# Altium project Middle Row.PrjPcb
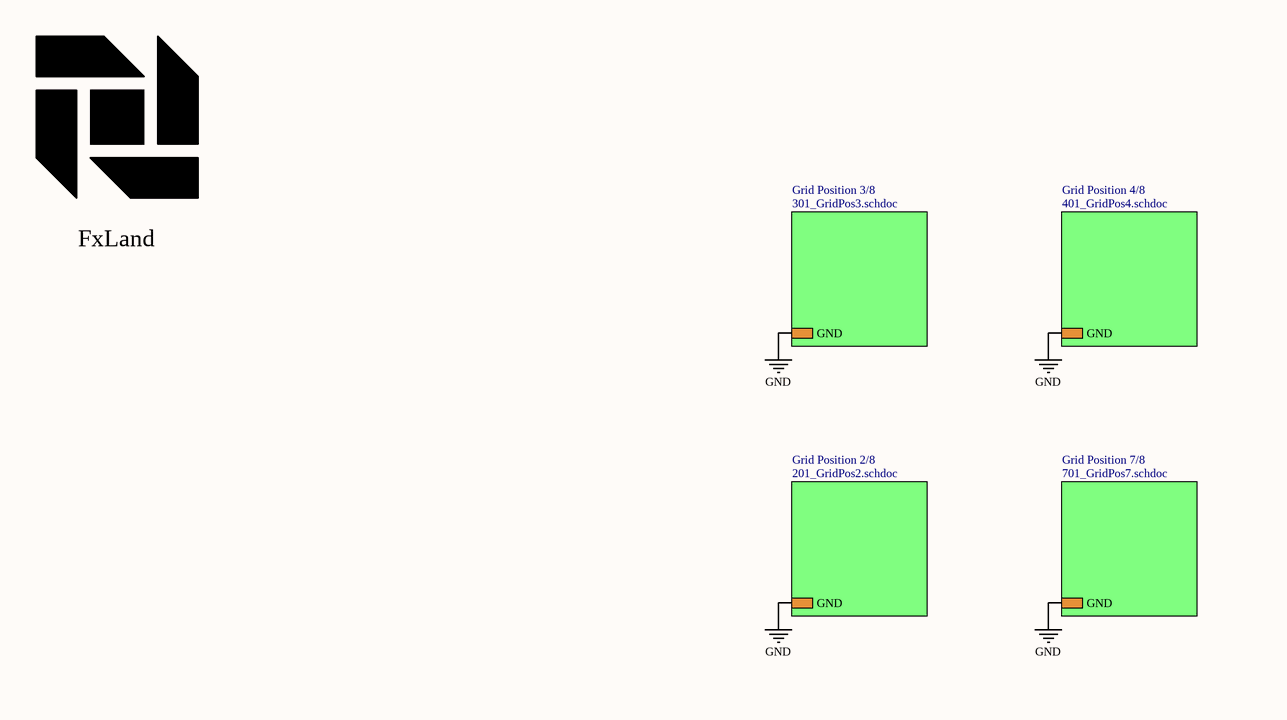
[diagram p0: 001_top.SchDoc, left]
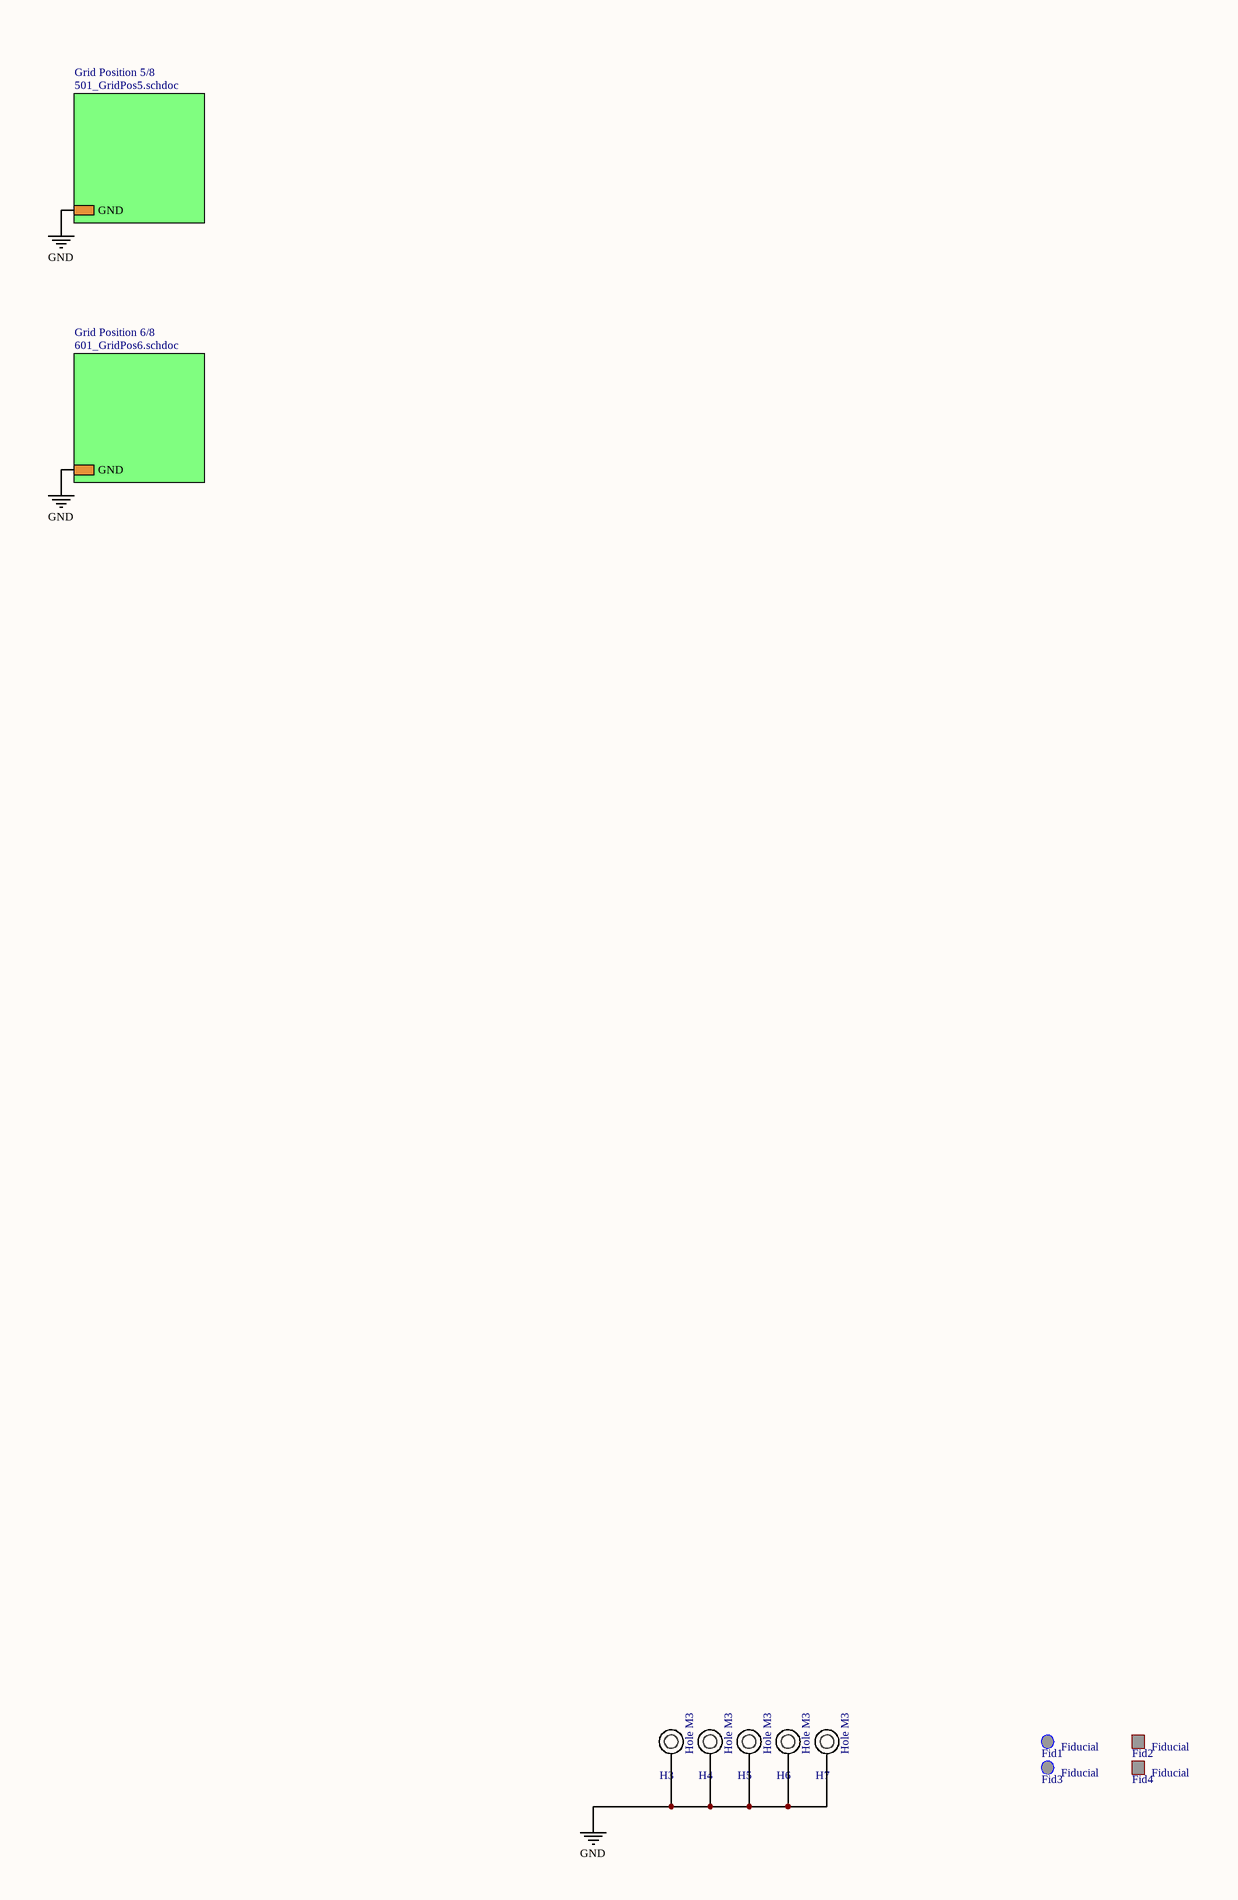
[diagram p1: 001_top.SchDoc, right]
DocNumber: P234; Rev: 1.7
7 sheets, 22 parts. Net scope: hierarchical (ports join the sheet entries above them; power ports are global).
Board file: Middle Row.PcbDoc
Sheets:
  001_top.SchDoc
    Grid Position 2/8 = 201_GridPos2.SchDoc
    Grid Position 4/8 = 401_GridPos4.SchDoc
    Grid Position 5/8 = 501_GridPos5.SchDoc
    Grid Position 3/8 = 301_GridPos3.SchDoc
    Grid Position 6/8 = 601_GridPos6.SchDoc
    Grid Position 7/8 = 701_GridPos7.SchDoc

## Sheet 001_top.SchDoc
size A2; Organization: Greenfield Tech Solutions; Address1: Molendreef 33; Address2: Ossendrecht; Address3: 4641CS; Address4: The Netherlands; DocumentNumber: P234; Revision: 1.7; SheetNumber: 1; SheetTotal: 7

### Parts
Fid1  Fiducial  [FidR_1.0mm]
Fid2  Fiducial  [FidS_1.0mm]
Fid3  Fiducial  [FidR_1.0mm]
Fid4  Fiducial  [FidS_1.0mm]
H3  Hole M3  [HOLE_M3]
H4  Hole M3  [HOLE_M3]
H5  Hole M3  [HOLE_M3]
H6  Hole M3  [HOLE_M3]
H7  Hole M3  [HOLE_M3]
Logo_FxLand?  FxLand  [Logo_FxLand_3]  (value not drawn)

### Sub-sheets
Grid Position 2/8 = 201_GridPos2.schdoc: GND
Grid Position 3/8 = 301_GridPos3.schdoc: GND
Grid Position 4/8 = 401_GridPos4.schdoc: GND
Grid Position 5/8 = 501_GridPos5.schdoc: GND
Grid Position 6/8 = 601_GridPos6.schdoc: GND
Grid Position 7/8 = 701_GridPos7.schdoc: GND

### Nets
GND: H3.1 H4.1 H5.1 H6.1 H7.1 ; sheet Grid Position 2/8/GND, sheet Grid Position 4/8/GND, sheet Grid Position 5/8/GND, sheet Grid Position 3/8/GND, sheet Grid Position 6/8/GND, sheet Grid Position 7/8/GND

### Notes on the sheet
- Title
- Size:
- Date:
- File:
- A2
- Number:
- Time:
- Revision:
- Sheet
- of

### Library data of the parts
Fid1 Fid3 = ME0011: Fiducial Round 1mm; Part Number: ME0011; ID: 11; RefVal: Fiducial
Fid2 Fid4 = ME0012: Fiducial Sqaure 1mm; Part Number: ME0012; ID: 12; RefVal: Fiducial
H3-H7 = ME0001: Mounting Hole M3; Part Number: ME0001; ID: 1; RefVal: Hole M3
Logo_FxLand? = ME0008: Logo FxLand 3; Part Number: ME0008; ID: 8; RefVal: FxLand

## Sheet 201_GridPos2.SchDoc
size A2; Organization: Greenfield Tech Solutions; Address1: Molendreef 33; Address2: Ossendrecht; Address3: 4641CS; Address4: The Netherlands; DocumentNumber: P234; Revision: 1.7; SheetNumber: 2; SheetTotal: 7
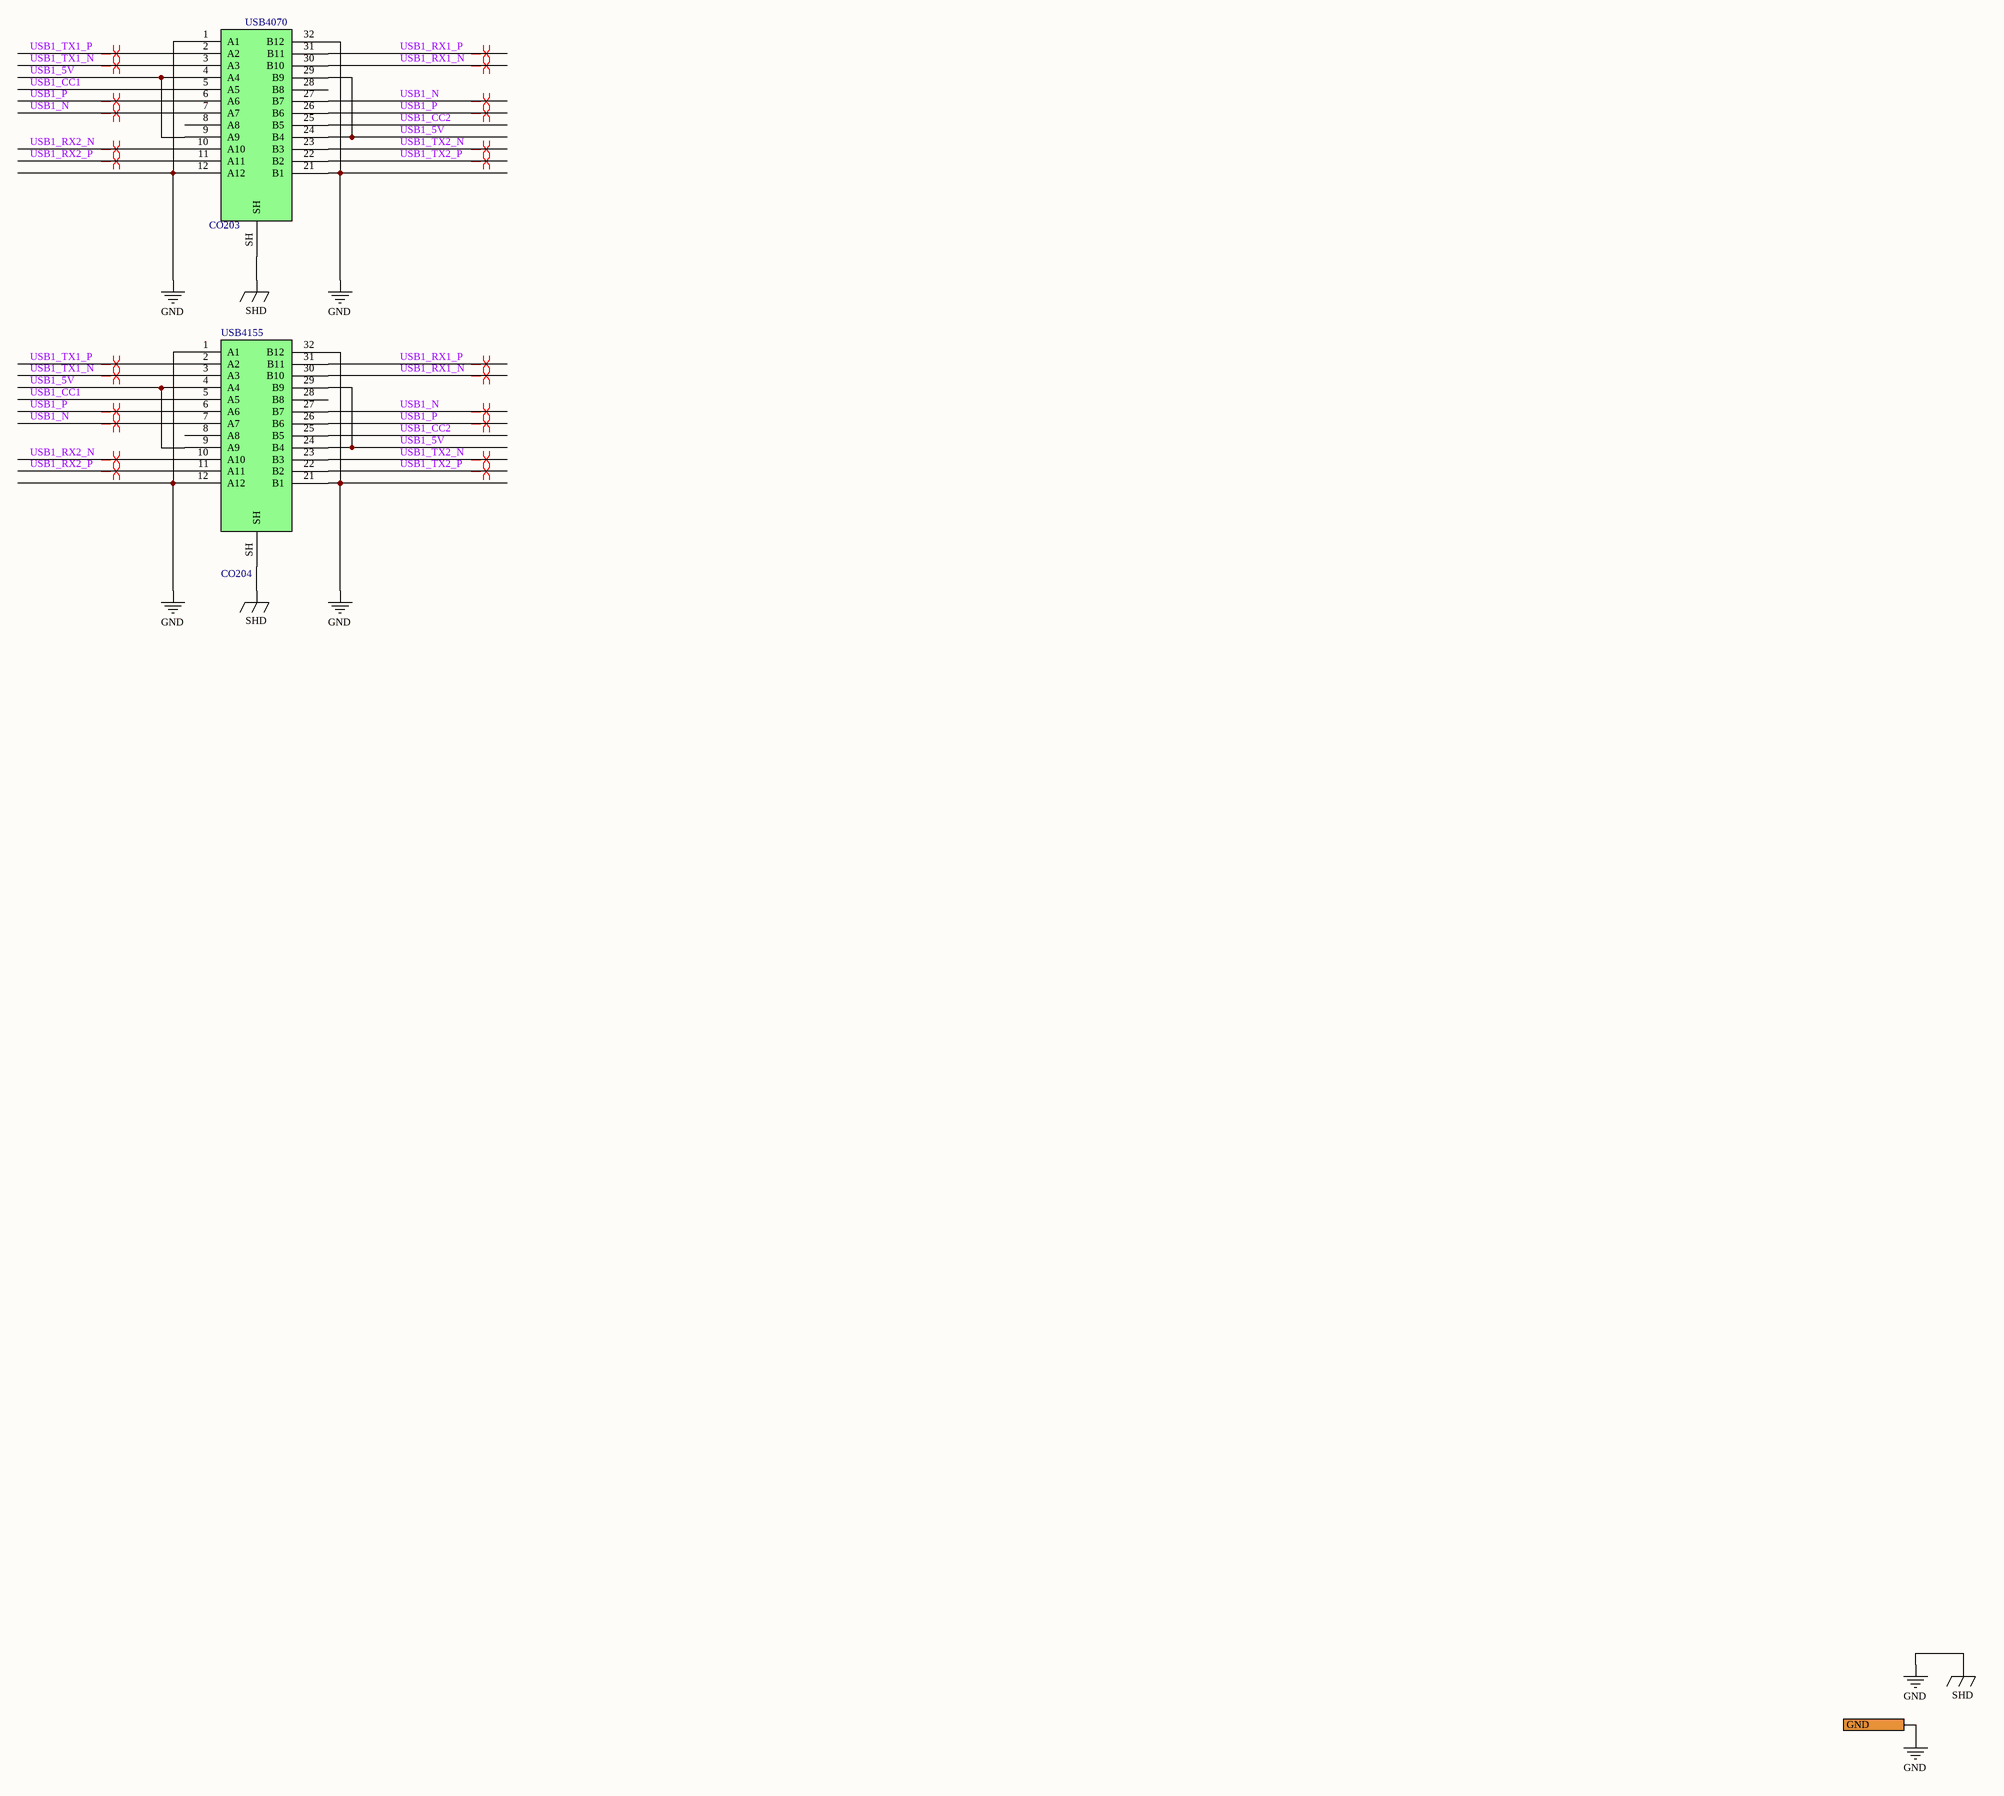
[diagram p2: 201_GridPos2.SchDoc]

### Parts
CO203  USB4070  [USB4070-30-C]
CO204  USB4155  [USB4155-03-C]

### Ports
GND

### Nets
GND: CO203.1(A1) CO203.12(A12) CO203.21(B1) CO203.32(B12) CO203.SH CO204.1(A1) CO204.12(A12) CO204.21(B1) CO204.32(B12) CO204.SH ; port GND  [also labelled SHD]
USB1_5V: CO203.4(A4) CO203.9(A9) CO203.24(B4) CO203.29(B9) CO204.4(A4) CO204.9(A9) CO204.24(B4) CO204.29(B9)
USB1_CC1: CO203.5(A5) CO204.5(A5)
USB1_CC2: CO203.25(B5) CO204.25(B5)
USB1_N: CO203.7(A7) CO203.27(B7) CO204.7(A7) CO204.27(B7)
USB1_P: CO203.6(A6) CO203.26(B6) CO204.6(A6) CO204.26(B6)
USB1_RX1_N: CO203.30(B10) CO204.30(B10)
USB1_RX1_P: CO203.31(B11) CO204.31(B11)
USB1_RX2_N: CO203.10(A10) CO204.10(A10)
USB1_RX2_P: CO203.11(A11) CO204.11(A11)
USB1_TX1_N: CO203.3(A3) CO204.3(A3)
USB1_TX1_P: CO203.2(A2) CO204.2(A2)
USB1_TX2_N: CO203.23(B3) CO204.23(B3)
USB1_TX2_P: CO203.22(B2) CO204.22(B2)

Not connected (* = marked no-connect by the designer): CO203 8(A8) 28(B8); CO204 8(A8) 28(B8)

### Layout directives
differential pair; differential pair class USB3: USB1_N, USB1_P, USB1_RX1_N, USB1_RX1_P, USB1_RX2_N, USB1_RX2_P, USB1_TX1_N, USB1_TX1_P, USB1_TX2_N, USB1_TX2_P

### Notes on the sheet
- Title
- Size:
- Date:
- File:
- A2
- Number:
- Time:
- Revision:
- Sheet
- of

### Library data of the parts
CO203 = CO0021: USB C connector Receptacle Vertical; Part Number: CO0021; ID: 16; RefVal: USB4070; ManfactPart: USB4070-30-C
CO204 = CO0031: USB C connector Plug Horizontal; Part Number: CO0031; ID: 30; RefVal: USB4155; ManfactPart: USB4155-03-C

## Sheet 401_GridPos4.SchDoc
size A2; Organization: Greenfield Tech Solutions; Address1: Molendreef 33; Address2: Ossendrecht; Address3: 4641CS; Address4: The Netherlands; DocumentNumber: P234; Revision: 1.7; SheetNumber: 4; SheetTotal: 7
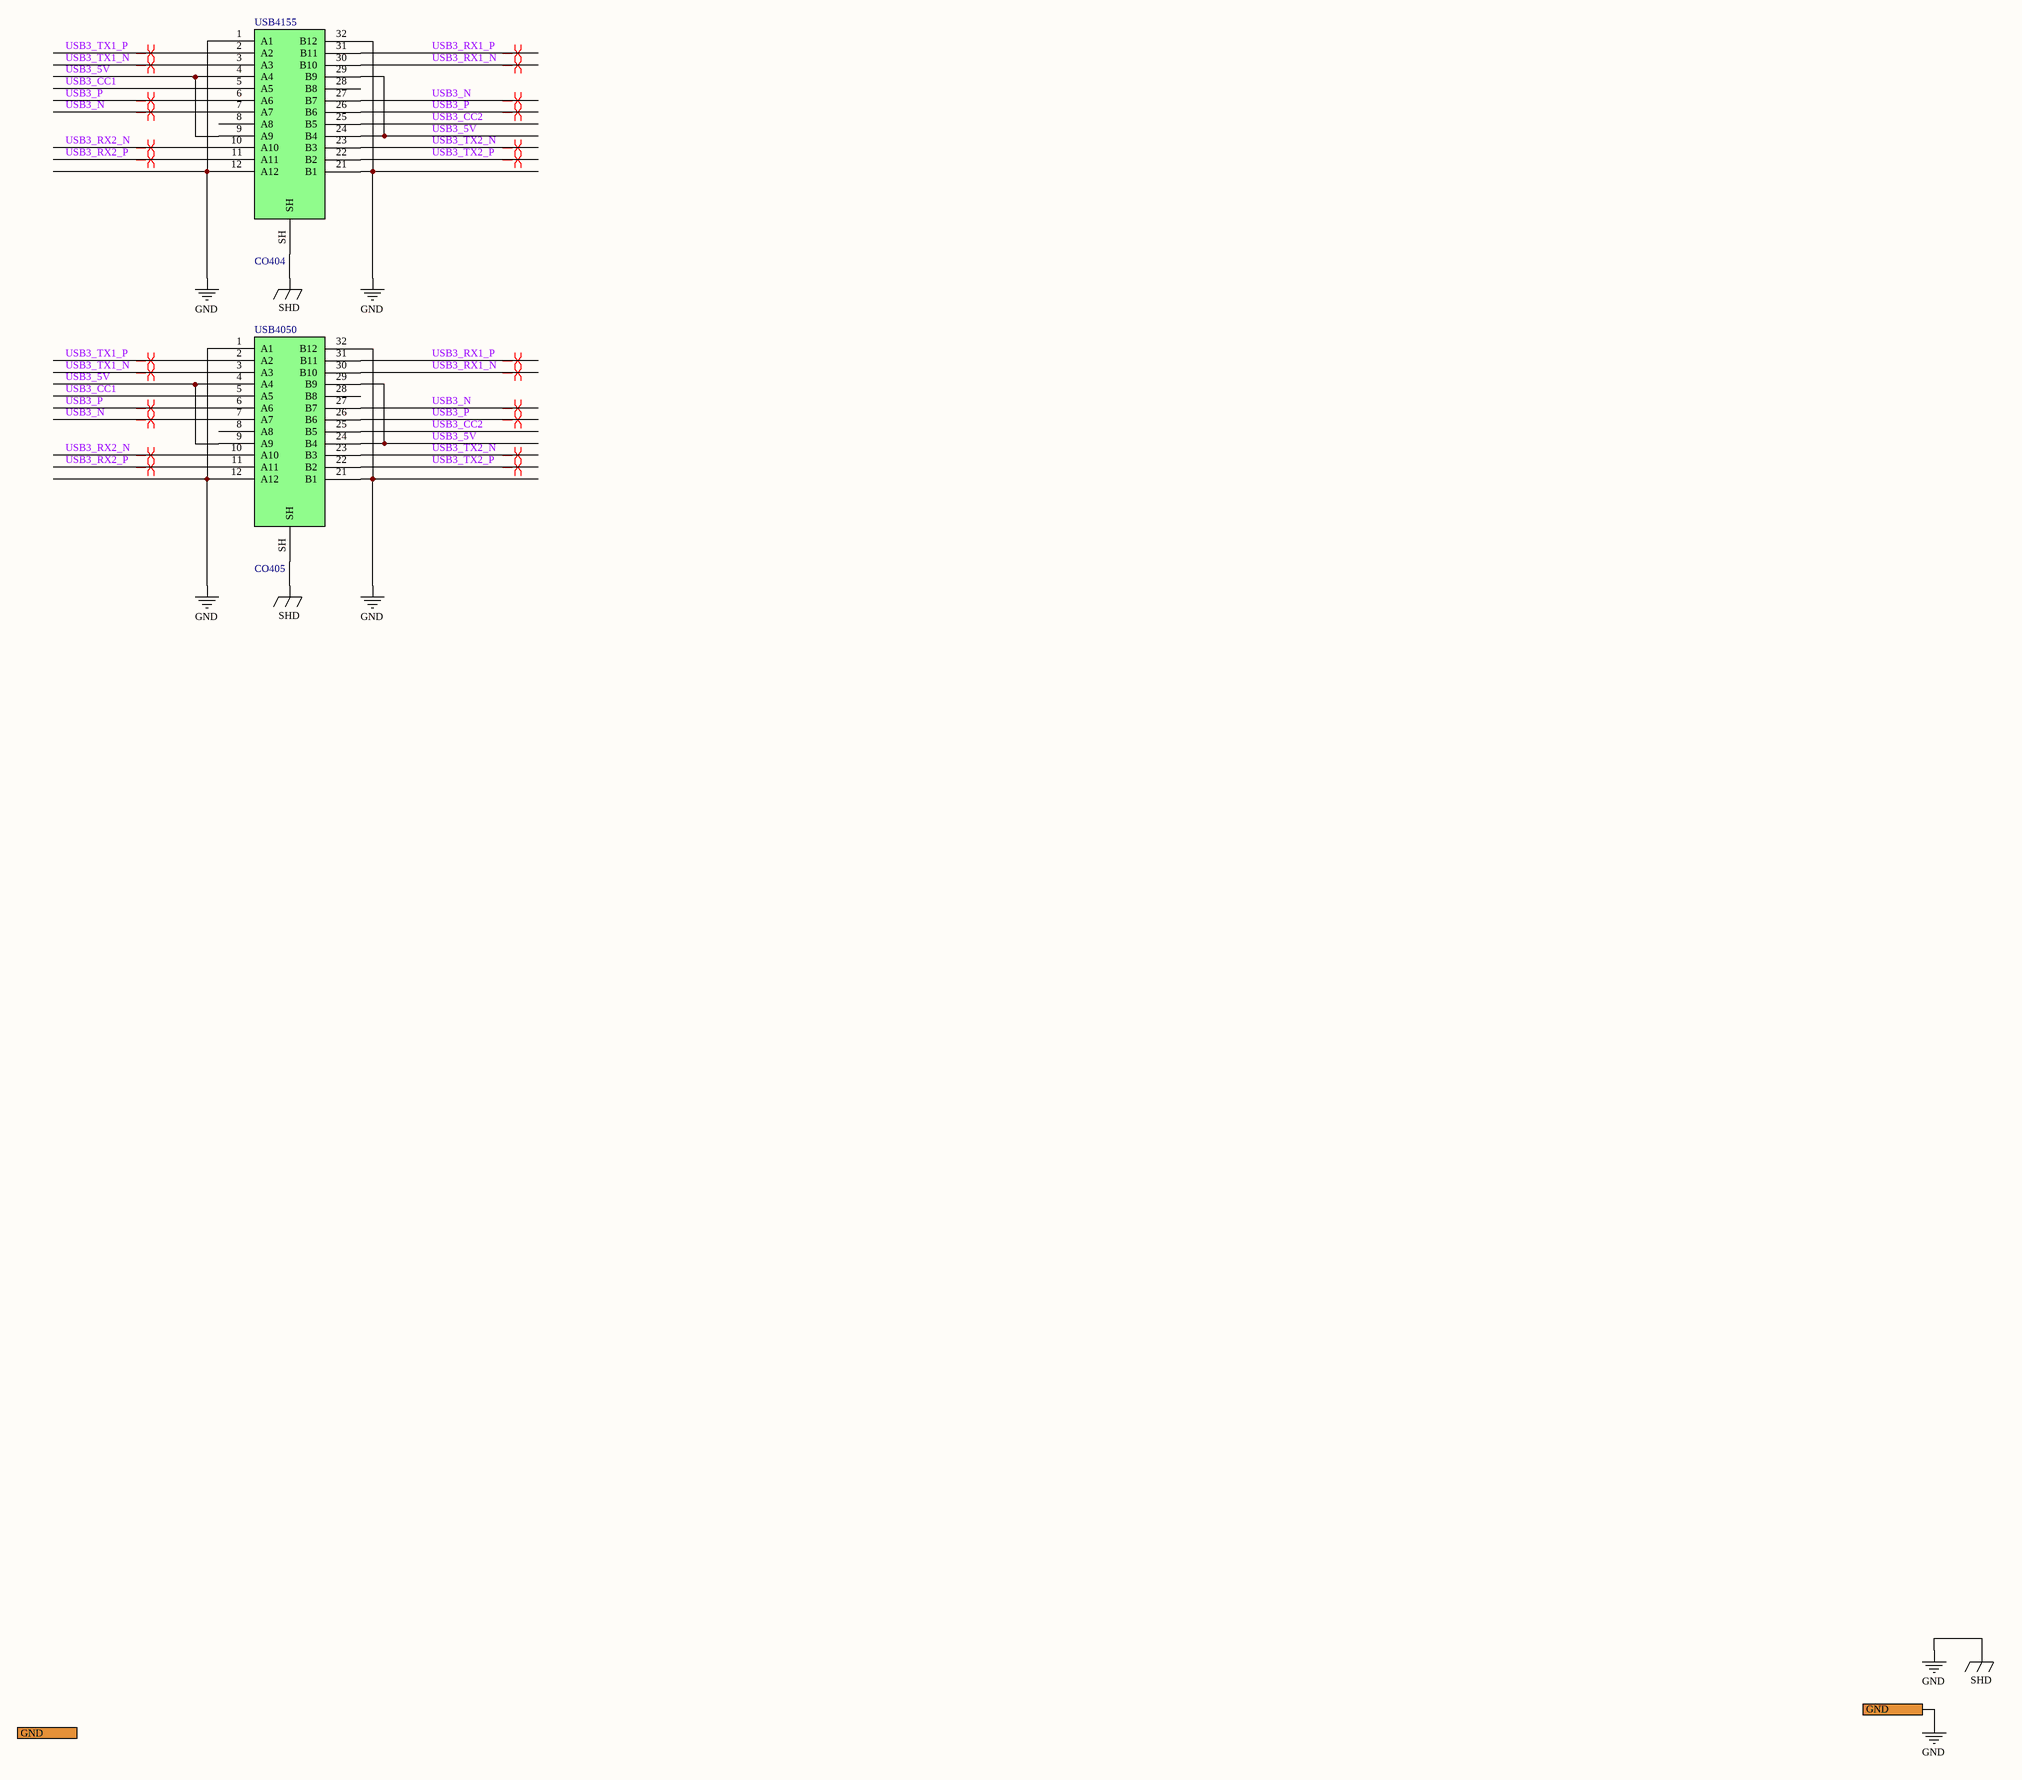
[diagram p3: 401_GridPos4.SchDoc]

### Parts
CO404  USB4155  [USB4155-03-C]
CO405  USB4050  [USB4050-30-A]

### Ports
GND

### Nets
GND: CO404.1(A1) CO404.12(A12) CO404.21(B1) CO404.32(B12) CO404.SH CO405.1(A1) CO405.12(A12) CO405.21(B1) CO405.32(B12) CO405.SH ; port GND  [also labelled SHD]
USB3_5V: CO404.4(A4) CO404.9(A9) CO404.24(B4) CO404.29(B9) CO405.4(A4) CO405.9(A9) CO405.24(B4) CO405.29(B9)
USB3_CC1: CO404.5(A5) CO405.5(A5)
USB3_CC2: CO404.25(B5) CO405.25(B5)
USB3_N: CO404.7(A7) CO404.27(B7) CO405.7(A7) CO405.27(B7)
USB3_P: CO404.6(A6) CO404.26(B6) CO405.6(A6) CO405.26(B6)
USB3_RX1_N: CO404.30(B10) CO405.30(B10)
USB3_RX1_P: CO404.31(B11) CO405.31(B11)
USB3_RX2_N: CO404.10(A10) CO405.10(A10)
USB3_RX2_P: CO404.11(A11) CO405.11(A11)
USB3_TX1_N: CO404.3(A3) CO405.3(A3)
USB3_TX1_P: CO404.2(A2) CO405.2(A2)
USB3_TX2_N: CO404.23(B3) CO405.23(B3)
USB3_TX2_P: CO404.22(B2) CO405.22(B2)

Not connected (* = marked no-connect by the designer): CO404 8(A8) 28(B8); CO405 8(A8) 28(B8)

### Layout directives
differential pair; differential pair class USB3: USB3_N, USB3_P, USB3_RX1_N, USB3_RX1_P, USB3_RX2_N, USB3_RX2_P, USB3_TX1_N, USB3_TX1_P, USB3_TX2_N, USB3_TX2_P

### Notes on the sheet
- Title
- Size:
- Date:
- File:
- A2
- Number:
- Time:
- Revision:
- Sheet
- of

### Library data of the parts
CO404 = CO0031: as CO204 on sheet 201_GridPos2; RefVal: USB4155; ManfactPart: USB4155-03-C
CO405 = CO0039: USB C connector Receptacle Horizontal; Part Number: CO0039; ID: 39; RefVal: USB4050; ManfactPart: USB4050-30-A

## Sheet 501_GridPos5.SchDoc
size A2; Organization: Greenfield Tech Solutions; Address1: Molendreef 33; Address2: Ossendrecht; Address3: 4641CS; Address4: The Netherlands; DocumentNumber: P234; Revision: 1.7; SheetNumber: 5; SheetTotal: 7
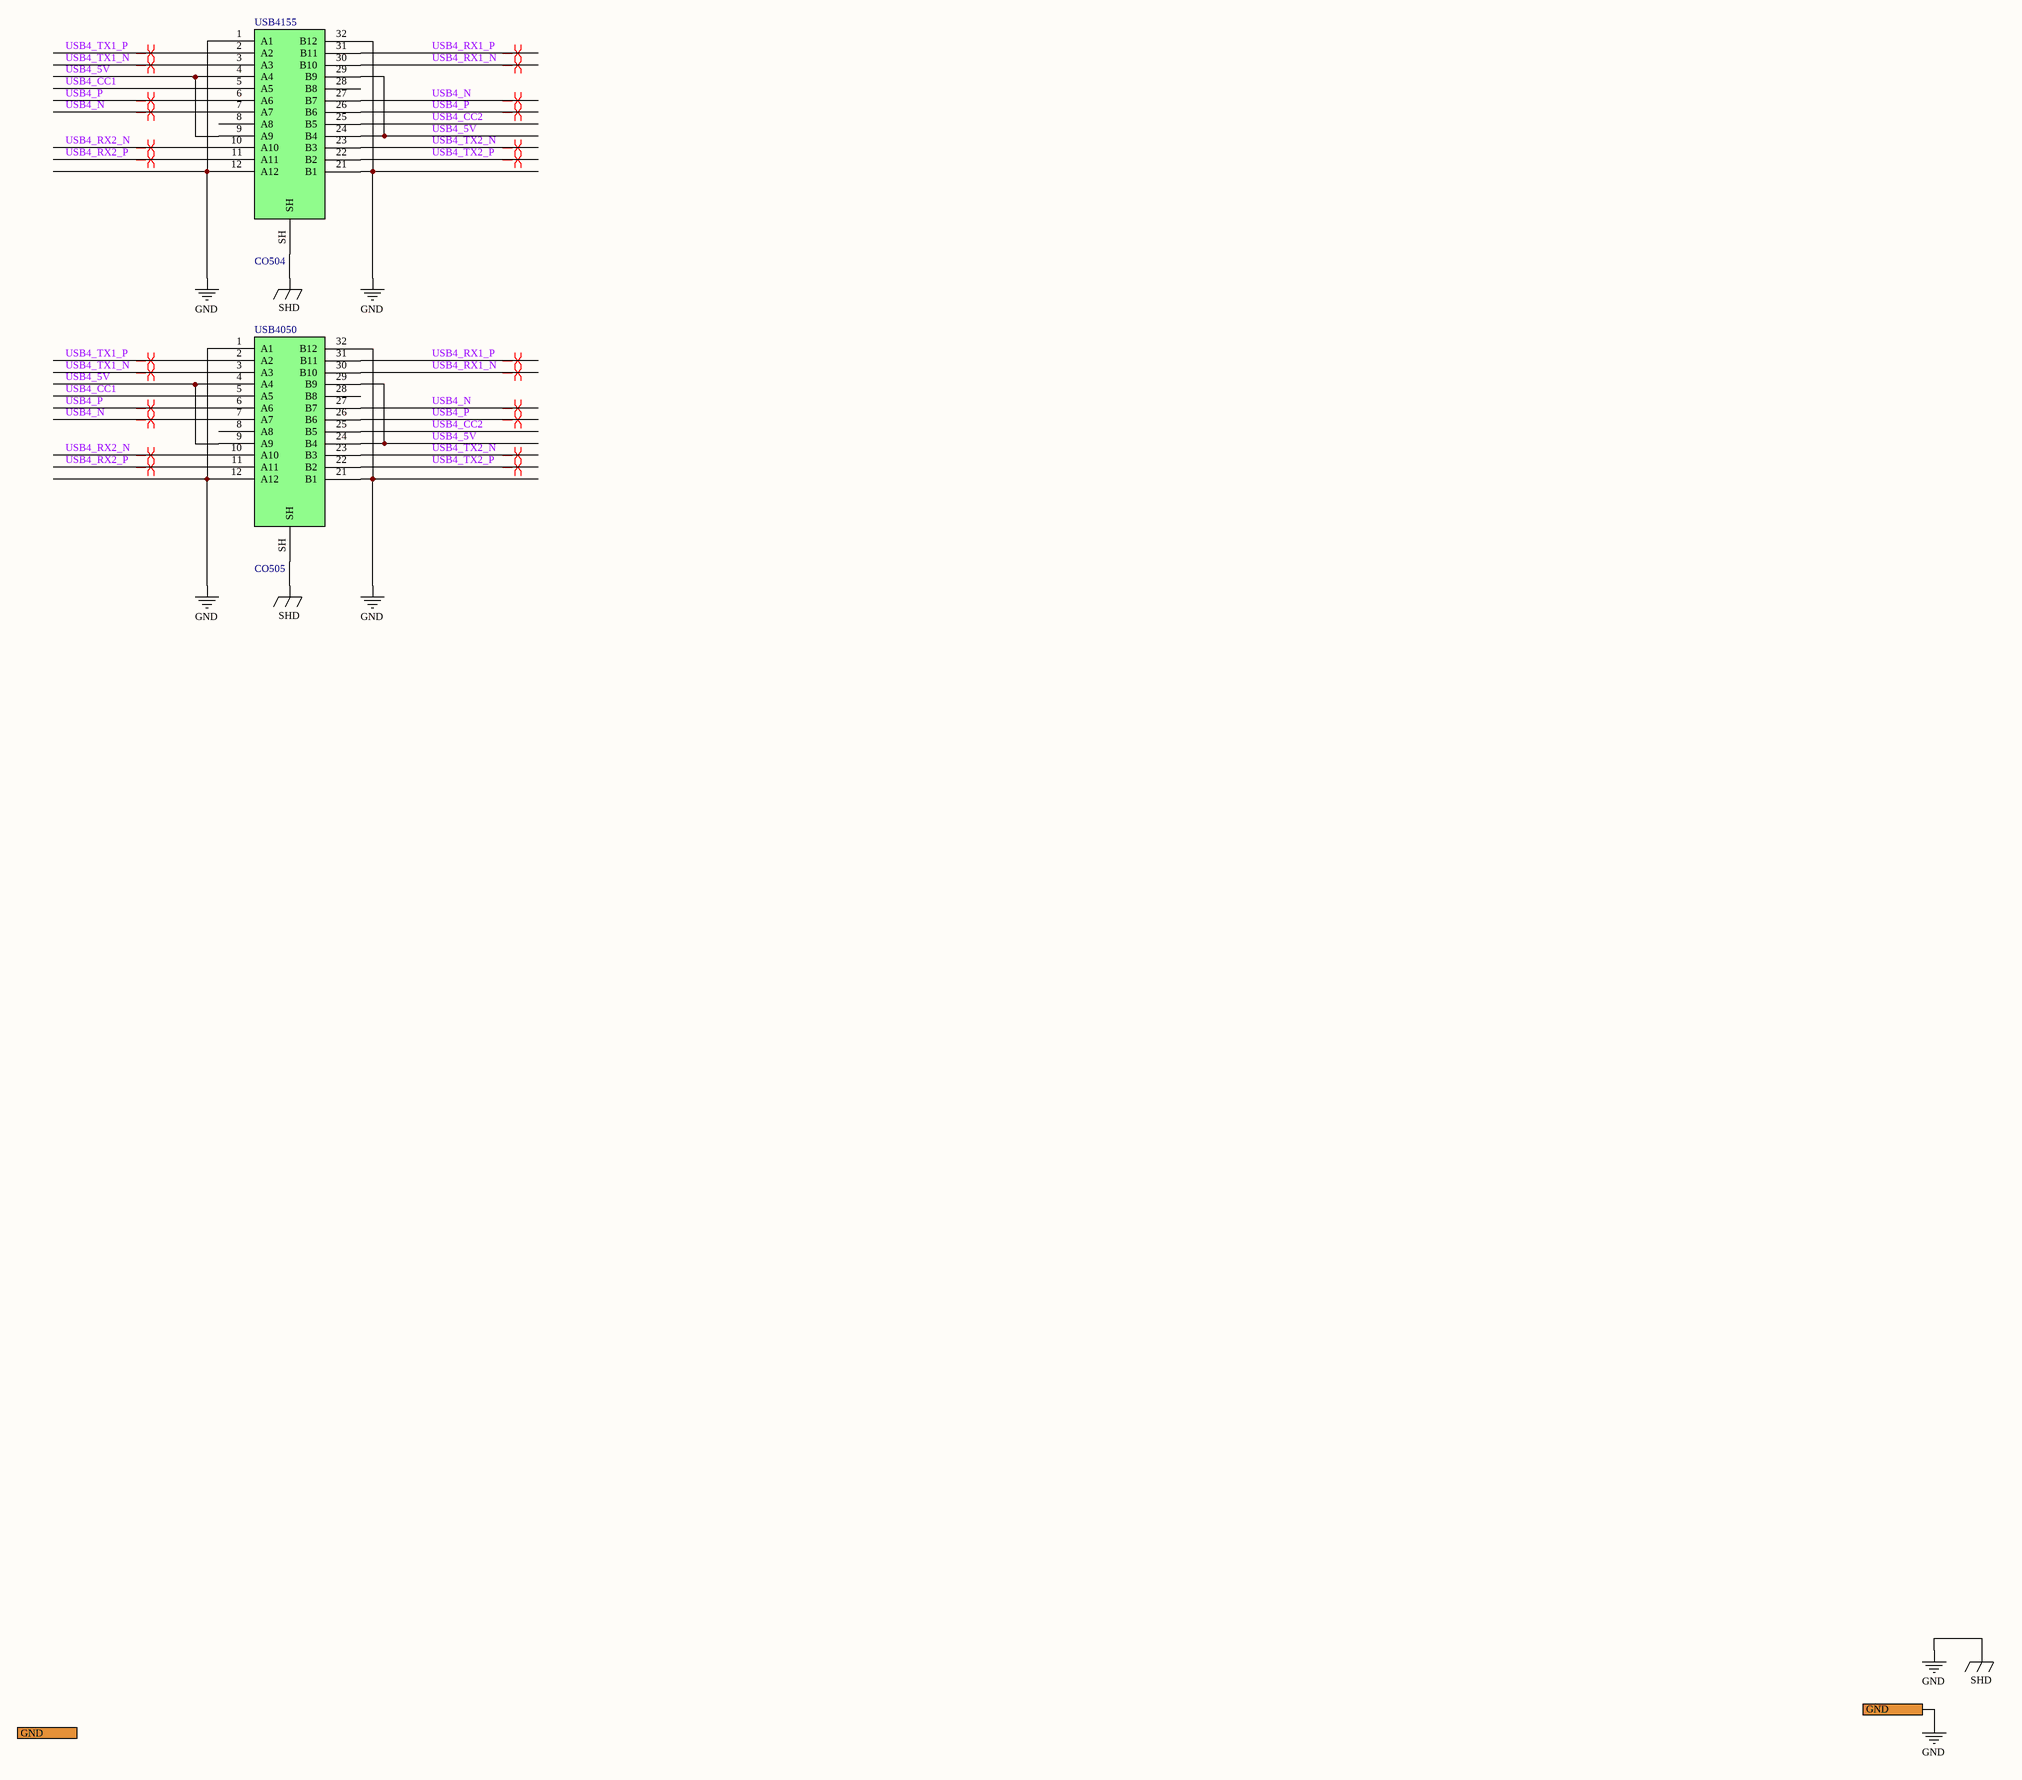
[diagram p4: 501_GridPos5.SchDoc]

### Parts
CO504  USB4155  [USB4155-03-C]
CO505  USB4050  [USB4050-30-A]

### Ports
GND

### Nets
GND: CO504.1(A1) CO504.12(A12) CO504.21(B1) CO504.32(B12) CO504.SH CO505.1(A1) CO505.12(A12) CO505.21(B1) CO505.32(B12) CO505.SH ; port GND  [also labelled SHD]
USB4_5V: CO504.4(A4) CO504.9(A9) CO504.24(B4) CO504.29(B9) CO505.4(A4) CO505.9(A9) CO505.24(B4) CO505.29(B9)
USB4_CC1: CO504.5(A5) CO505.5(A5)
USB4_CC2: CO504.25(B5) CO505.25(B5)
USB4_N: CO504.7(A7) CO504.27(B7) CO505.7(A7) CO505.27(B7)
USB4_P: CO504.6(A6) CO504.26(B6) CO505.6(A6) CO505.26(B6)
USB4_RX1_N: CO504.30(B10) CO505.30(B10)
USB4_RX1_P: CO504.31(B11) CO505.31(B11)
USB4_RX2_N: CO504.10(A10) CO505.10(A10)
USB4_RX2_P: CO504.11(A11) CO505.11(A11)
USB4_TX1_N: CO504.3(A3) CO505.3(A3)
USB4_TX1_P: CO504.2(A2) CO505.2(A2)
USB4_TX2_N: CO504.23(B3) CO505.23(B3)
USB4_TX2_P: CO504.22(B2) CO505.22(B2)

Not connected (* = marked no-connect by the designer): CO504 8(A8) 28(B8); CO505 8(A8) 28(B8)

### Layout directives
differential pair; differential pair class USB3: USB4_N, USB4_P, USB4_RX1_N, USB4_RX1_P, USB4_RX2_N, USB4_RX2_P, USB4_TX1_N, USB4_TX1_P, USB4_TX2_N, USB4_TX2_P

### Notes on the sheet
- Title
- Size:
- Date:
- File:
- A2
- Number:
- Time:
- Revision:
- Sheet
- of

### Library data of the parts
CO504 = CO0031: as CO204 on sheet 201_GridPos2; RefVal: USB4155; ManfactPart: USB4155-03-C
CO505 = CO0039: as CO405 on sheet 401_GridPos4; RefVal: USB4050; ManfactPart: USB4050-30-A

## Sheet 301_GridPos3.SchDoc
size A2; Organization: Greenfield Tech Solutions; Address1: Molendreef 33; Address2: Ossendrecht; Address3: 4641CS; Address4: The Netherlands; DocumentNumber: P234; Revision: 1.7; SheetNumber: 3; SheetTotal: 7
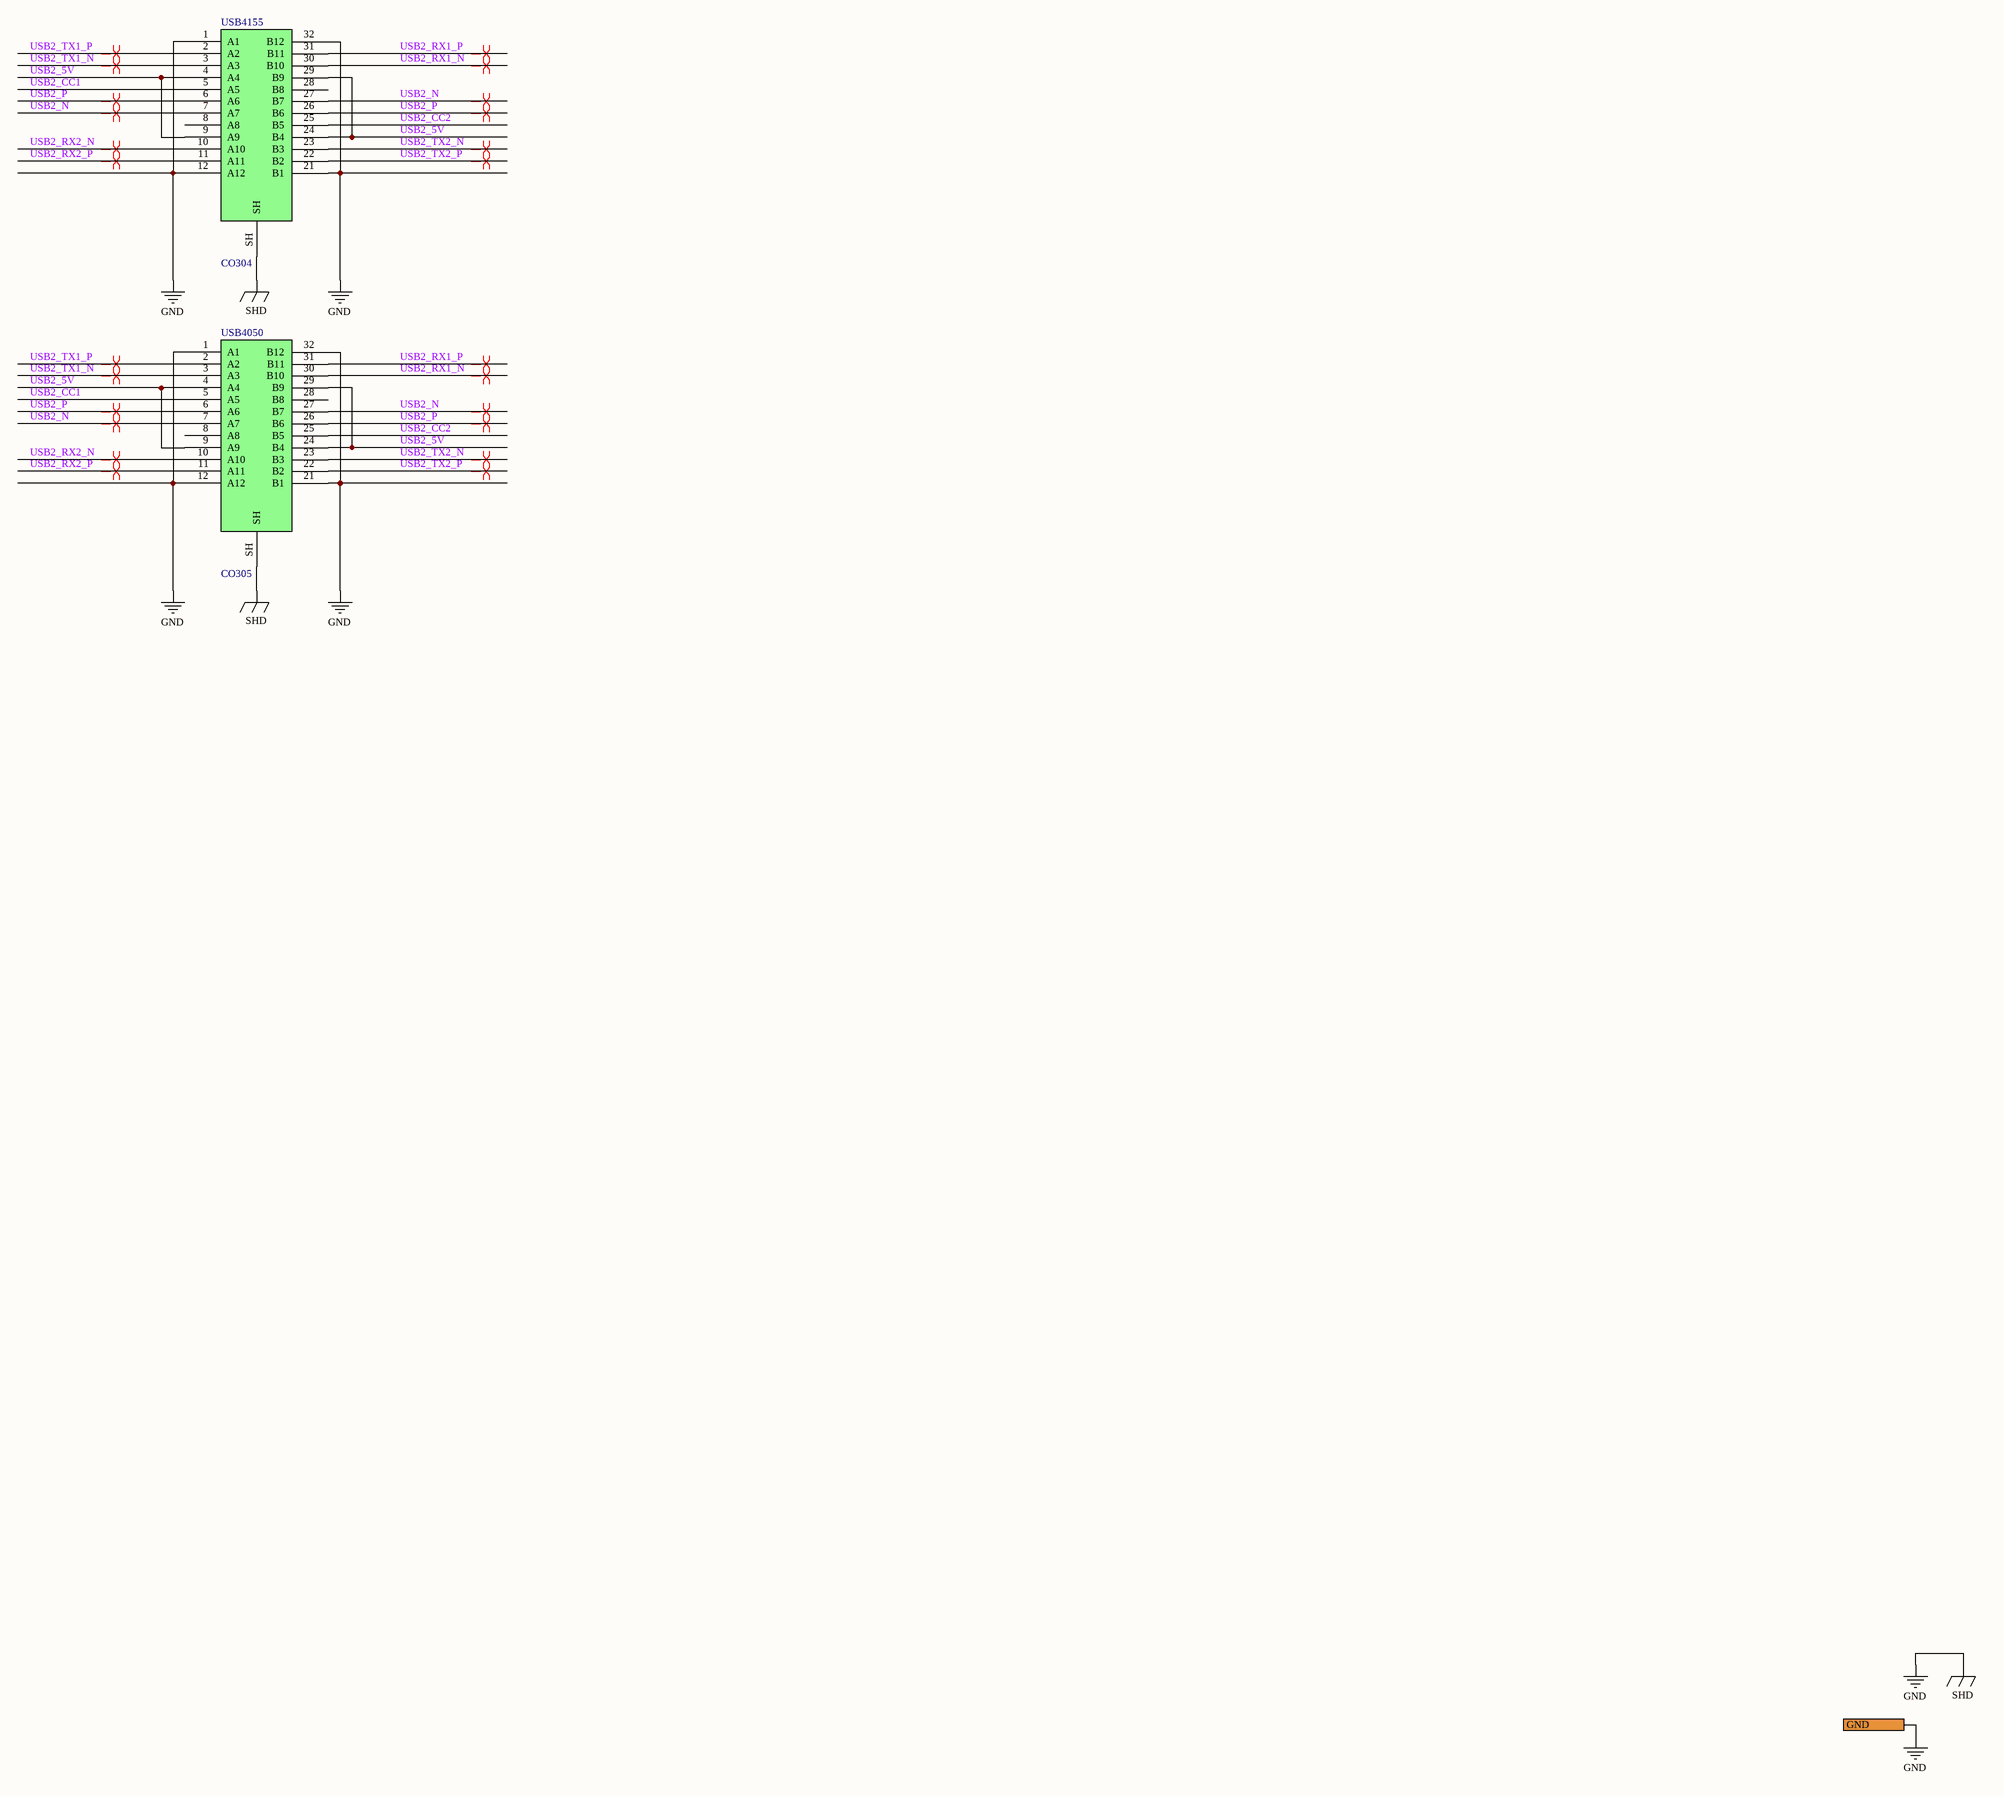
[diagram p5: 301_GridPos3.SchDoc]

### Parts
CO304  USB4155  [USB4155-03-C]
CO305  USB4050  [USB4050-30-A]

### Ports
GND

### Nets
GND: CO304.1(A1) CO304.12(A12) CO304.21(B1) CO304.32(B12) CO304.SH CO305.1(A1) CO305.12(A12) CO305.21(B1) CO305.32(B12) CO305.SH ; port GND  [also labelled SHD]
USB2_5V: CO304.4(A4) CO304.9(A9) CO304.24(B4) CO304.29(B9) CO305.4(A4) CO305.9(A9) CO305.24(B4) CO305.29(B9)
USB2_CC1: CO304.5(A5) CO305.5(A5)
USB2_CC2: CO304.25(B5) CO305.25(B5)
USB2_N: CO304.7(A7) CO304.27(B7) CO305.7(A7) CO305.27(B7)
USB2_P: CO304.6(A6) CO304.26(B6) CO305.6(A6) CO305.26(B6)
USB2_RX1_N: CO304.30(B10) CO305.30(B10)
USB2_RX1_P: CO304.31(B11) CO305.31(B11)
USB2_RX2_N: CO304.10(A10) CO305.10(A10)
USB2_RX2_P: CO304.11(A11) CO305.11(A11)
USB2_TX1_N: CO304.3(A3) CO305.3(A3)
USB2_TX1_P: CO304.2(A2) CO305.2(A2)
USB2_TX2_N: CO304.23(B3) CO305.23(B3)
USB2_TX2_P: CO304.22(B2) CO305.22(B2)

Not connected (* = marked no-connect by the designer): CO304 8(A8) 28(B8); CO305 8(A8) 28(B8)

### Layout directives
differential pair; differential pair class USB3: USB2_N, USB2_P, USB2_RX1_N, USB2_RX1_P, USB2_RX2_N, USB2_RX2_P, USB2_TX1_N, USB2_TX1_P, USB2_TX2_N, USB2_TX2_P

### Notes on the sheet
- Title
- Size:
- Date:
- File:
- A2
- Number:
- Time:
- Revision:
- Sheet
- of

### Library data of the parts
CO304 = CO0031: as CO204 on sheet 201_GridPos2; RefVal: USB4155; ManfactPart: USB4155-03-C
CO305 = CO0039: as CO405 on sheet 401_GridPos4; RefVal: USB4050; ManfactPart: USB4050-30-A

## Sheet 601_GridPos6.SchDoc
size A2; Organization: Greenfield Tech Solutions; Address1: Molendreef 33; Address2: Ossendrecht; Address3: 4641CS; Address4: The Netherlands; DocumentNumber: P234; Revision: 1.7; SheetNumber: 6; SheetTotal: 7
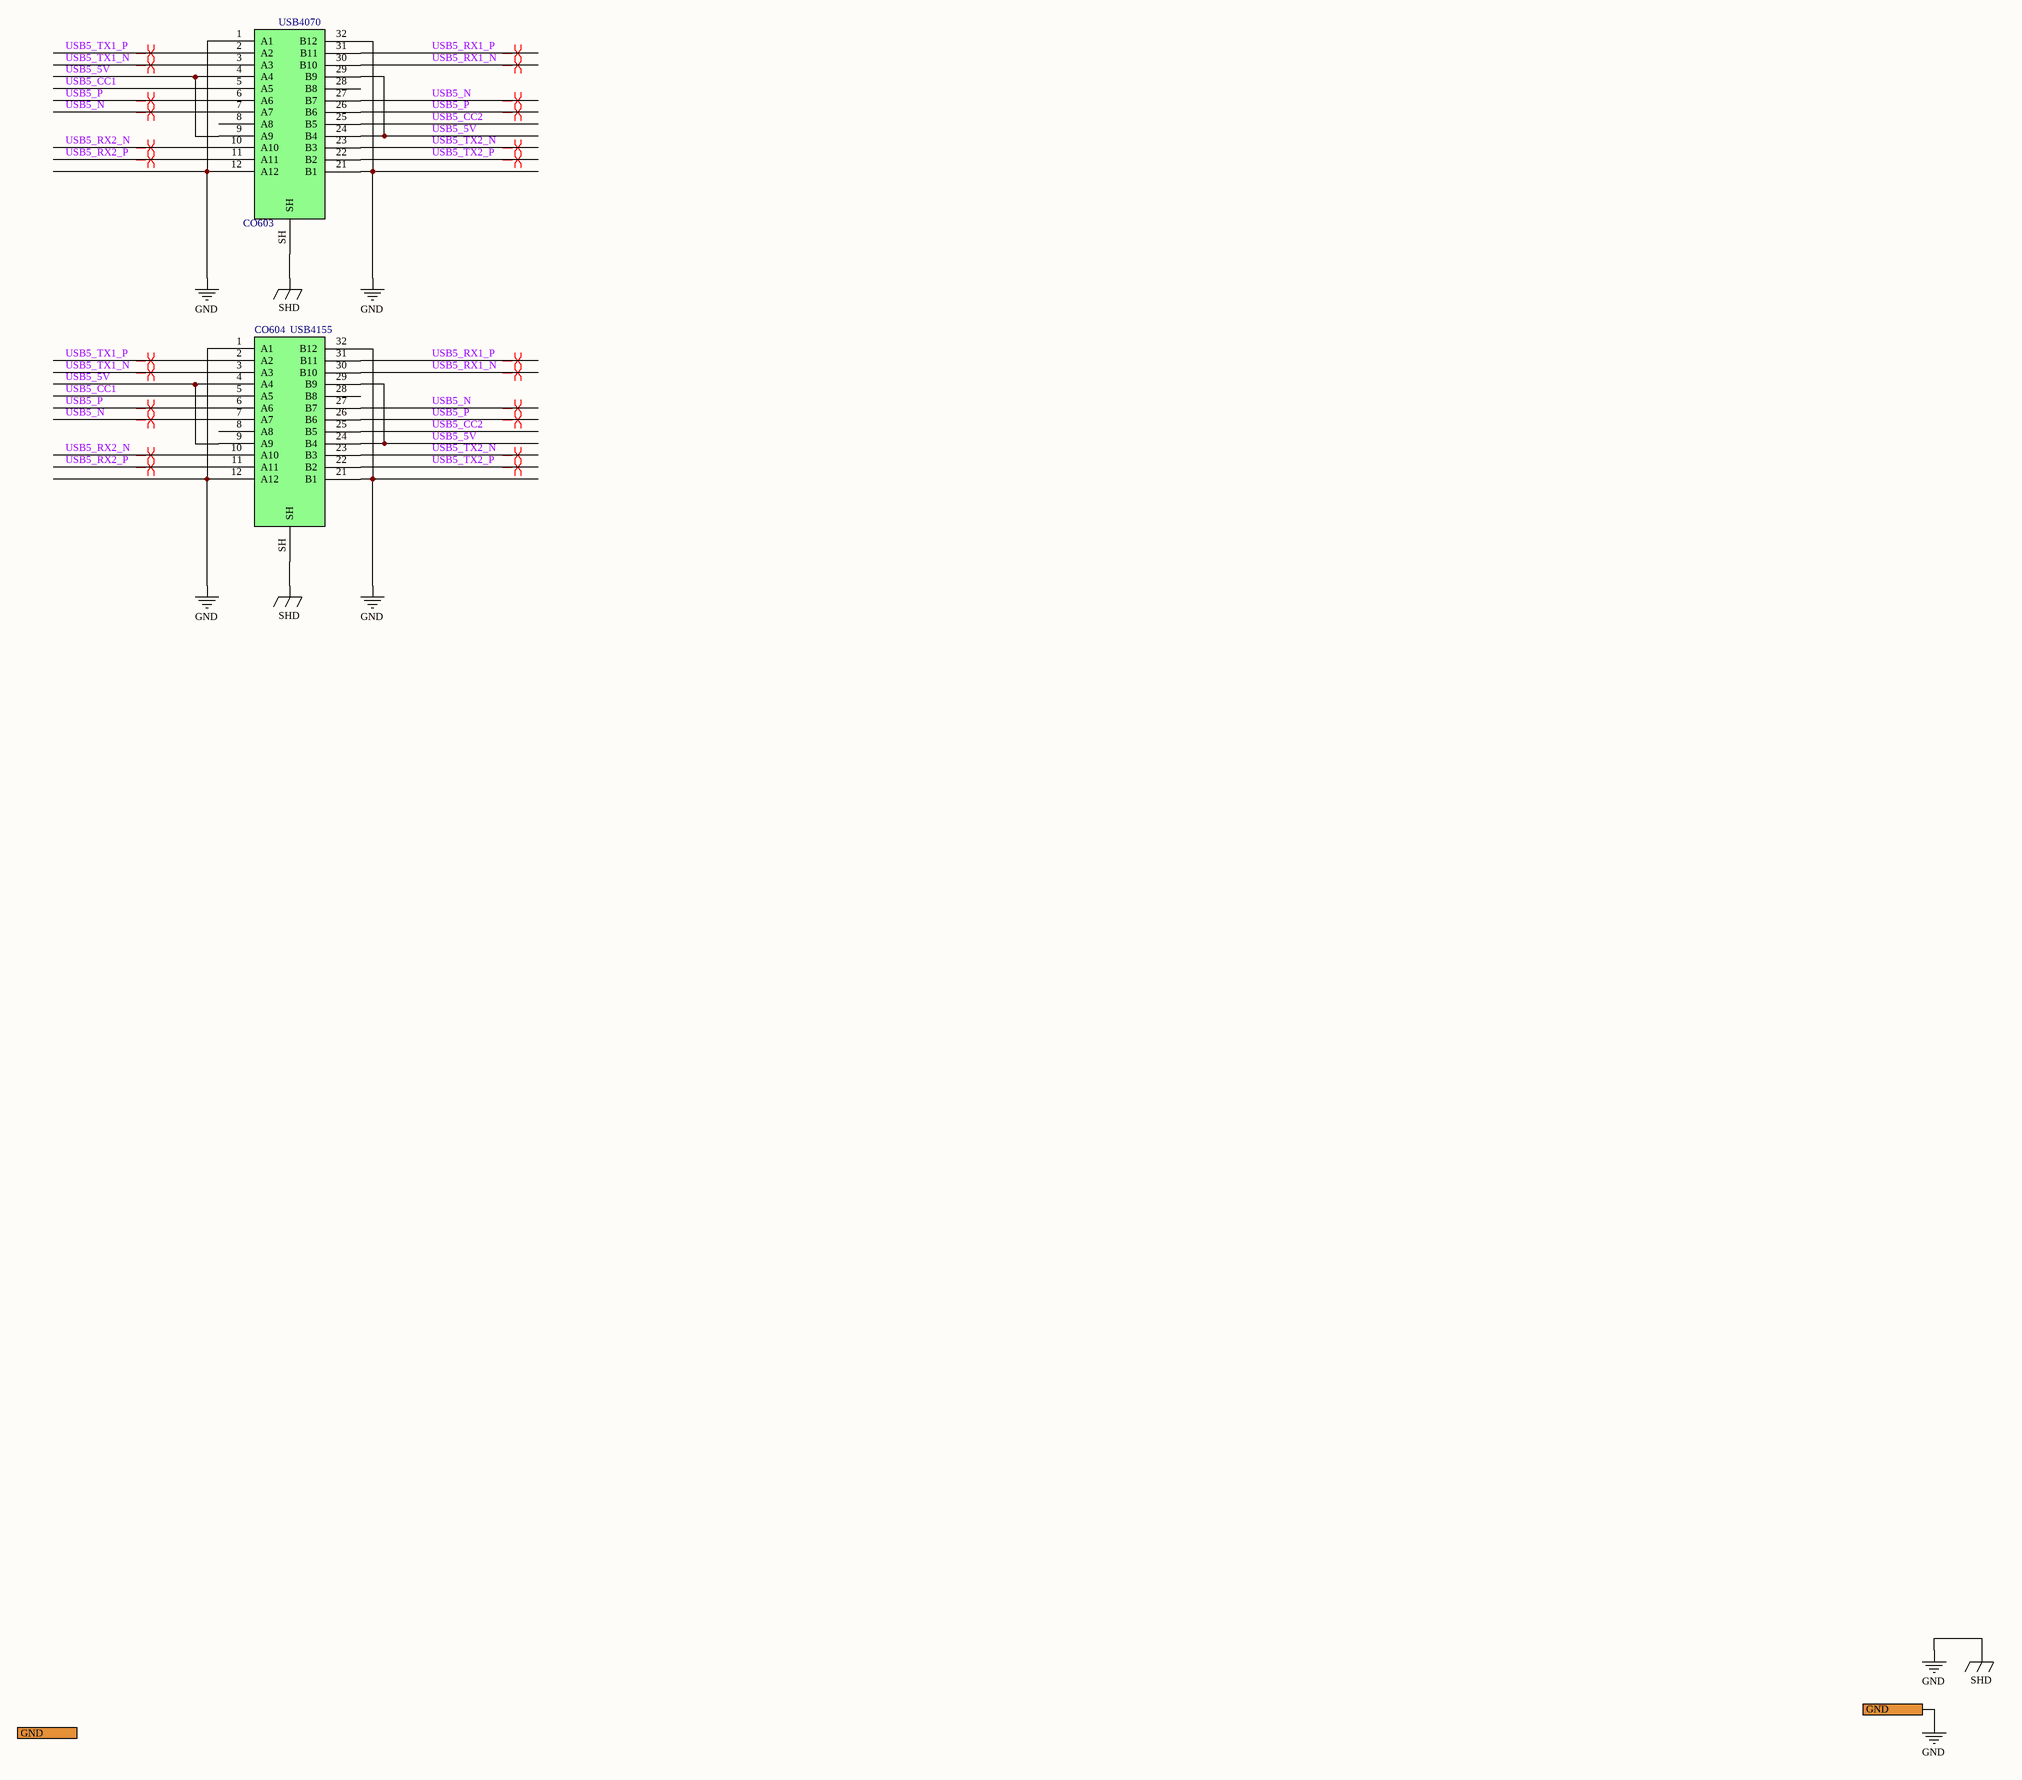
[diagram p6: 601_GridPos6.SchDoc]

### Parts
CO603  USB4070  [USB4070-30-C]
CO604  USB4155  [USB4155-03-C]

### Ports
GND

### Nets
GND: CO603.1(A1) CO603.12(A12) CO603.21(B1) CO603.32(B12) CO603.SH CO604.1(A1) CO604.12(A12) CO604.21(B1) CO604.32(B12) CO604.SH ; port GND  [also labelled SHD]
USB5_5V: CO603.4(A4) CO603.9(A9) CO603.24(B4) CO603.29(B9) CO604.4(A4) CO604.9(A9) CO604.24(B4) CO604.29(B9)
USB5_CC1: CO603.5(A5) CO604.5(A5)
USB5_CC2: CO603.25(B5) CO604.25(B5)
USB5_N: CO603.7(A7) CO603.27(B7) CO604.7(A7) CO604.27(B7)
USB5_P: CO603.6(A6) CO603.26(B6) CO604.6(A6) CO604.26(B6)
USB5_RX1_N: CO603.30(B10) CO604.30(B10)
USB5_RX1_P: CO603.31(B11) CO604.31(B11)
USB5_RX2_N: CO603.10(A10) CO604.10(A10)
USB5_RX2_P: CO603.11(A11) CO604.11(A11)
USB5_TX1_N: CO603.3(A3) CO604.3(A3)
USB5_TX1_P: CO603.2(A2) CO604.2(A2)
USB5_TX2_N: CO603.23(B3) CO604.23(B3)
USB5_TX2_P: CO603.22(B2) CO604.22(B2)

Not connected (* = marked no-connect by the designer): CO603 8(A8) 28(B8); CO604 8(A8) 28(B8)

### Layout directives
differential pair; differential pair class USB3: USB5_N, USB5_P, USB5_RX1_N, USB5_RX1_P, USB5_RX2_N, USB5_RX2_P, USB5_TX1_N, USB5_TX1_P, USB5_TX2_N, USB5_TX2_P

### Notes on the sheet
- Title
- Size:
- Date:
- File:
- A2
- Number:
- Time:
- Revision:
- Sheet
- of

### Library data of the parts
CO603 = CO0021: as CO203 on sheet 201_GridPos2; RefVal: USB4070; ManfactPart: USB4070-30-C
CO604 = CO0031: as CO204 on sheet 201_GridPos2; RefVal: USB4155; ManfactPart: USB4155-03-C

## Sheet 701_GridPos7.SchDoc
size A2; Organization: Greenfield Tech Solutions; Address1: Molendreef 33; Address2: Ossendrecht; Address3: 4641CS; Address4: The Netherlands; DocumentNumber: P234; Revision: 1.7; SheetNumber: 7; SheetTotal: 7
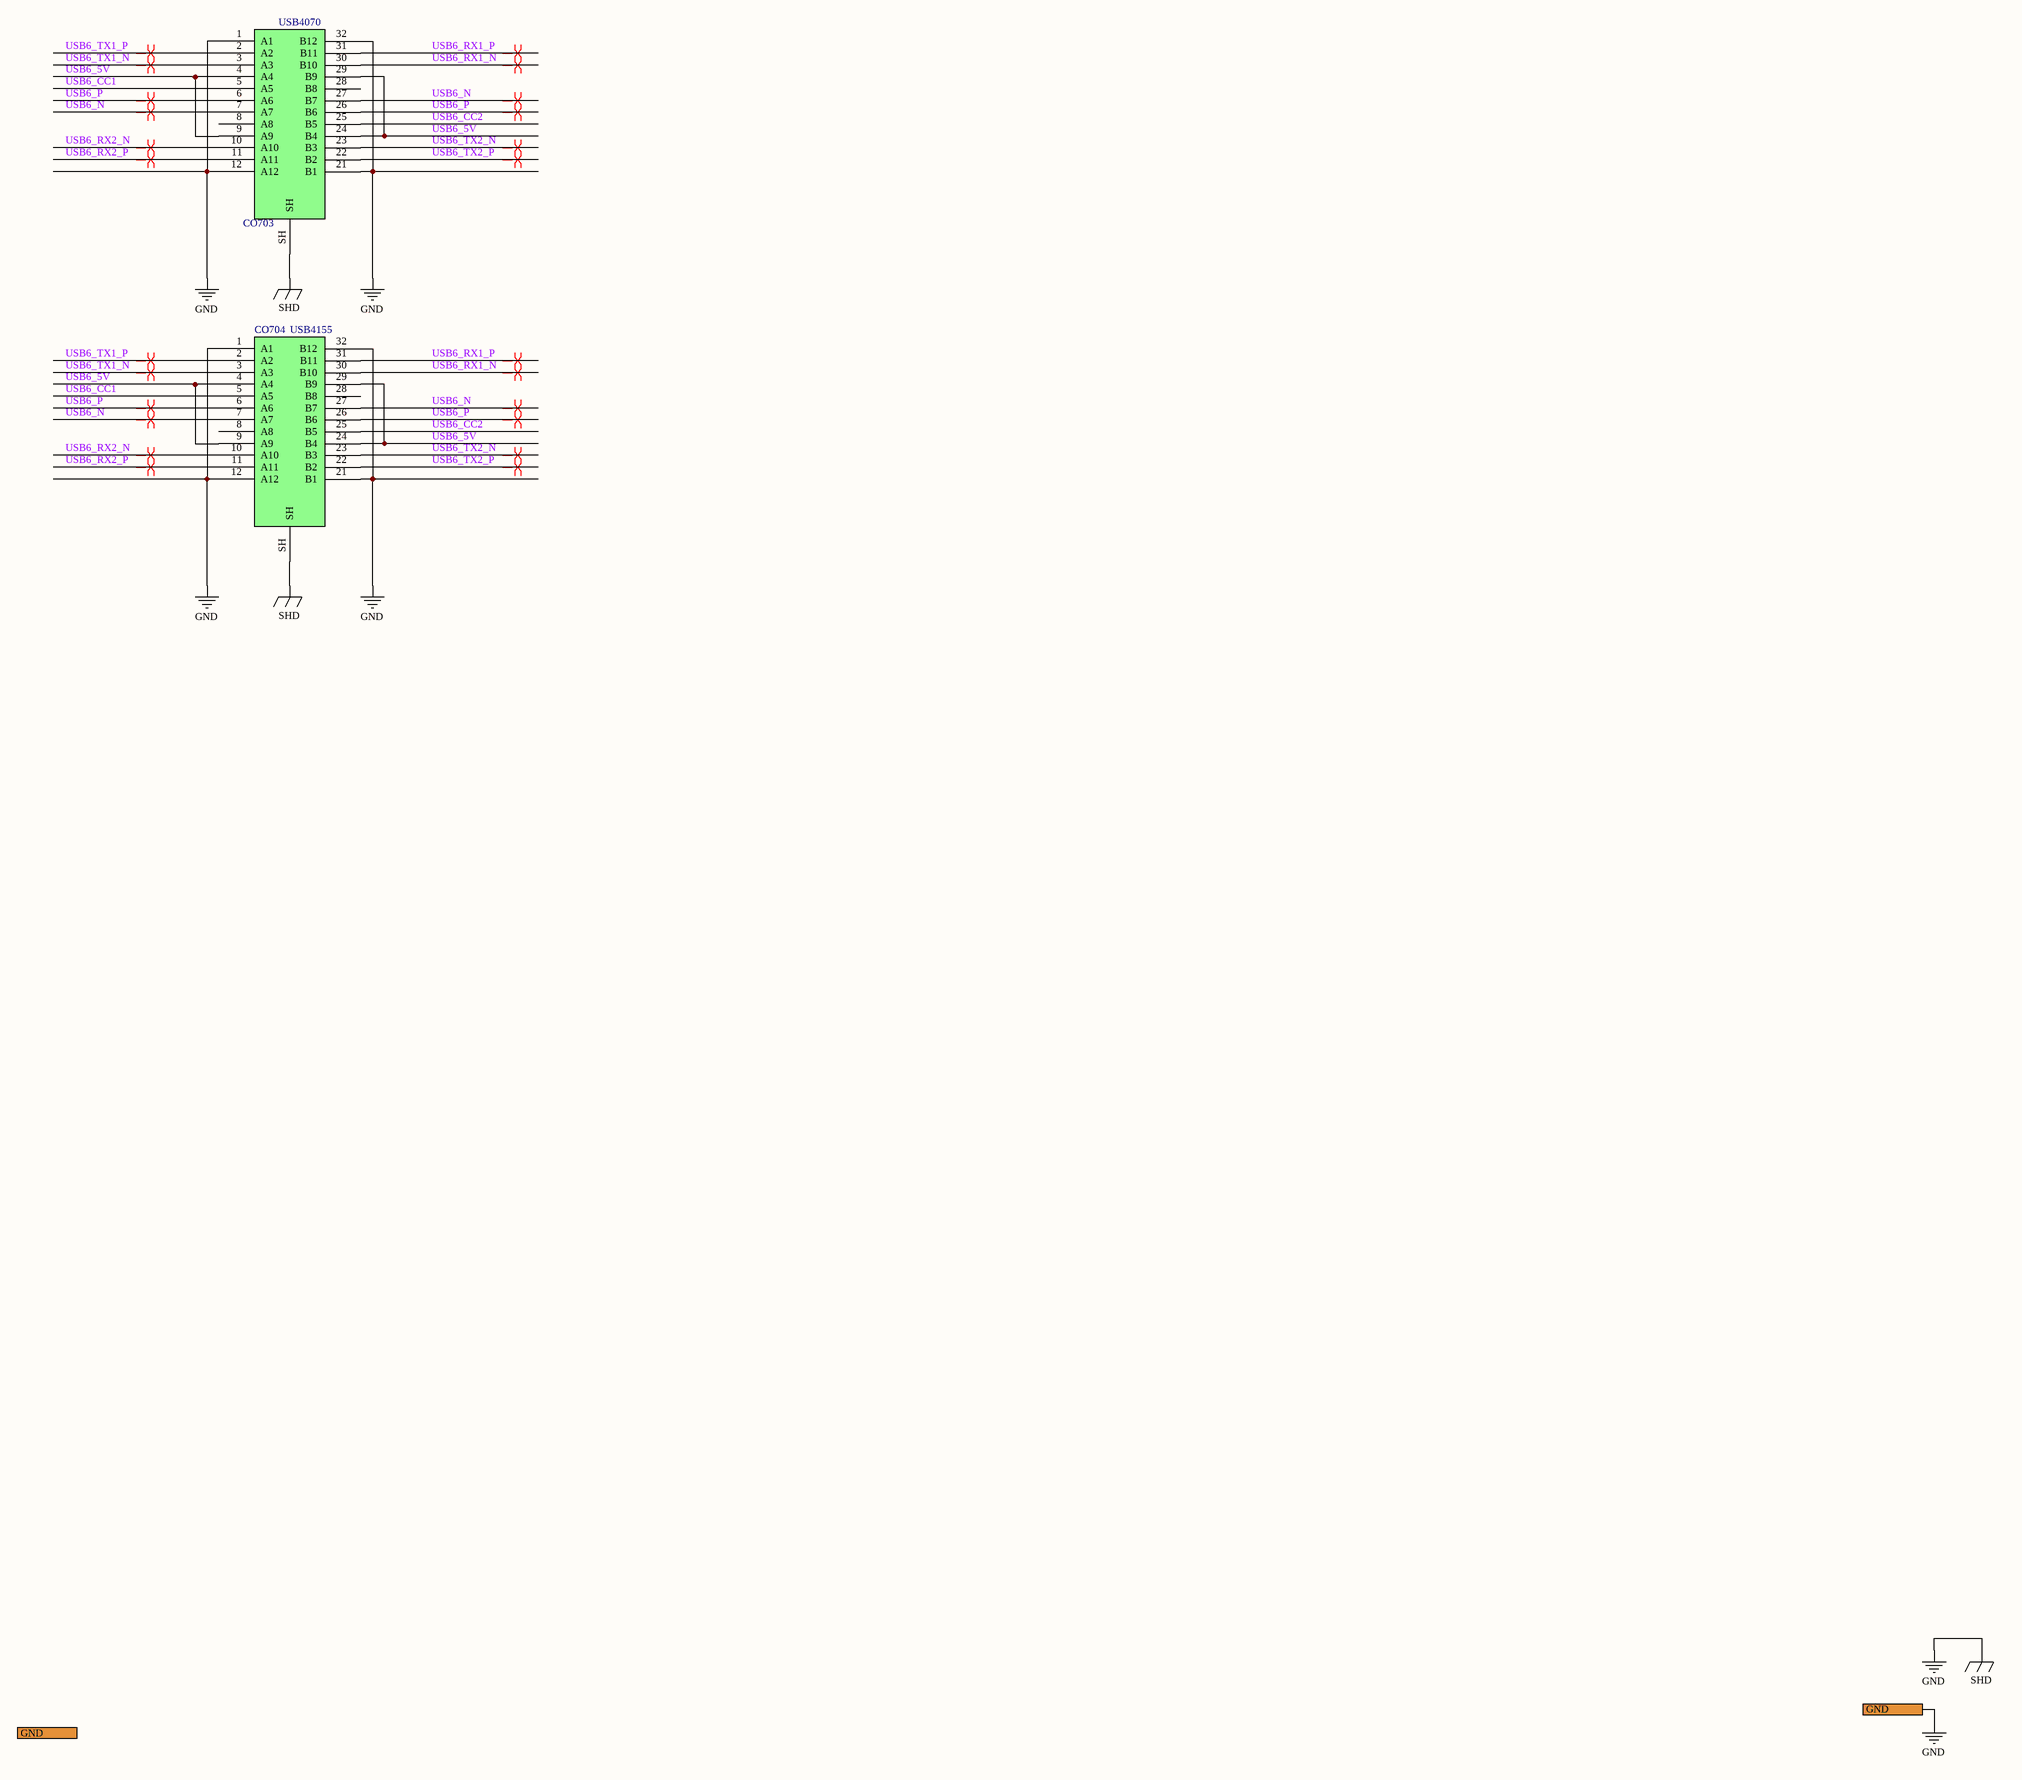
[diagram p7: 701_GridPos7.SchDoc]

### Parts
CO703  USB4070  [USB4070-30-C]
CO704  USB4155  [USB4155-03-C]

### Ports
GND

### Nets
GND: CO703.1(A1) CO703.12(A12) CO703.21(B1) CO703.32(B12) CO703.SH CO704.1(A1) CO704.12(A12) CO704.21(B1) CO704.32(B12) CO704.SH ; port GND  [also labelled SHD]
USB6_5V: CO703.4(A4) CO703.9(A9) CO703.24(B4) CO703.29(B9) CO704.4(A4) CO704.9(A9) CO704.24(B4) CO704.29(B9)
USB6_CC1: CO703.5(A5) CO704.5(A5)
USB6_CC2: CO703.25(B5) CO704.25(B5)
USB6_N: CO703.7(A7) CO703.27(B7) CO704.7(A7) CO704.27(B7)
USB6_P: CO703.6(A6) CO703.26(B6) CO704.6(A6) CO704.26(B6)
USB6_RX1_N: CO703.30(B10) CO704.30(B10)
USB6_RX1_P: CO703.31(B11) CO704.31(B11)
USB6_RX2_N: CO703.10(A10) CO704.10(A10)
USB6_RX2_P: CO703.11(A11) CO704.11(A11)
USB6_TX1_N: CO703.3(A3) CO704.3(A3)
USB6_TX1_P: CO703.2(A2) CO704.2(A2)
USB6_TX2_N: CO703.23(B3) CO704.23(B3)
USB6_TX2_P: CO703.22(B2) CO704.22(B2)

Not connected (* = marked no-connect by the designer): CO703 8(A8) 28(B8); CO704 8(A8) 28(B8)

### Layout directives
differential pair; differential pair class USB3: USB6_N, USB6_P, USB6_RX1_N, USB6_RX1_P, USB6_RX2_N, USB6_RX2_P, USB6_TX1_N, USB6_TX1_P, USB6_TX2_N, USB6_TX2_P

### Notes on the sheet
- Title
- Size:
- Date:
- File:
- A2
- Number:
- Time:
- Revision:
- Sheet
- of

### Library data of the parts
CO703 = CO0021: as CO203 on sheet 201_GridPos2; RefVal: USB4070; ManfactPart: USB4070-30-C
CO704 = CO0031: as CO204 on sheet 201_GridPos2; RefVal: USB4155; ManfactPart: USB4155-03-C

## Nets that join several sheets
GND: 001_top (5 pins), 201_GridPos2 (10 pins), 401_GridPos4 (10 pins), 501_GridPos5 (10 pins), 301_GridPos3 (10 pins), 601_GridPos6 (10 pins), 701_GridPos7 (10 pins)